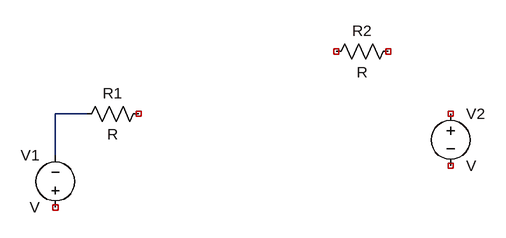
[diagram p0: schematic jfet.asc]
jfet.asc, the LTspice schematic file:
Version 4
SHEET 1 880 680
WIRE 32 112 -16 112
WIRE -16 176 -16 112
SYMBOL res 128 96 R90
WINDOW 0 0 56 VBottom 2
WINDOW 3 32 56 VTop 2
SYMATTR InstName R1
SYMBOL res 512 0 R90
WINDOW 0 0 56 VBottom 2
WINDOW 3 32 56 VTop 2
SYMATTR InstName R2
SYMBOL voltage -16 272 R180
WINDOW 0 24 96 Left 2
WINDOW 3 24 16 Left 2
SYMATTR InstName V1
SYMBOL voltage 592 96 R0
SYMATTR InstName V2

The netlist it stands for:
* jfet.asc
R1 NC_01 N001 R
R2 NC_02 NC_03 R
V1 NC_04 N001 V
V2 NC_05 NC_06 V
.backanno
.end